# EAGLE board video_test (EAGLE 6.6.0), part 1 of 2
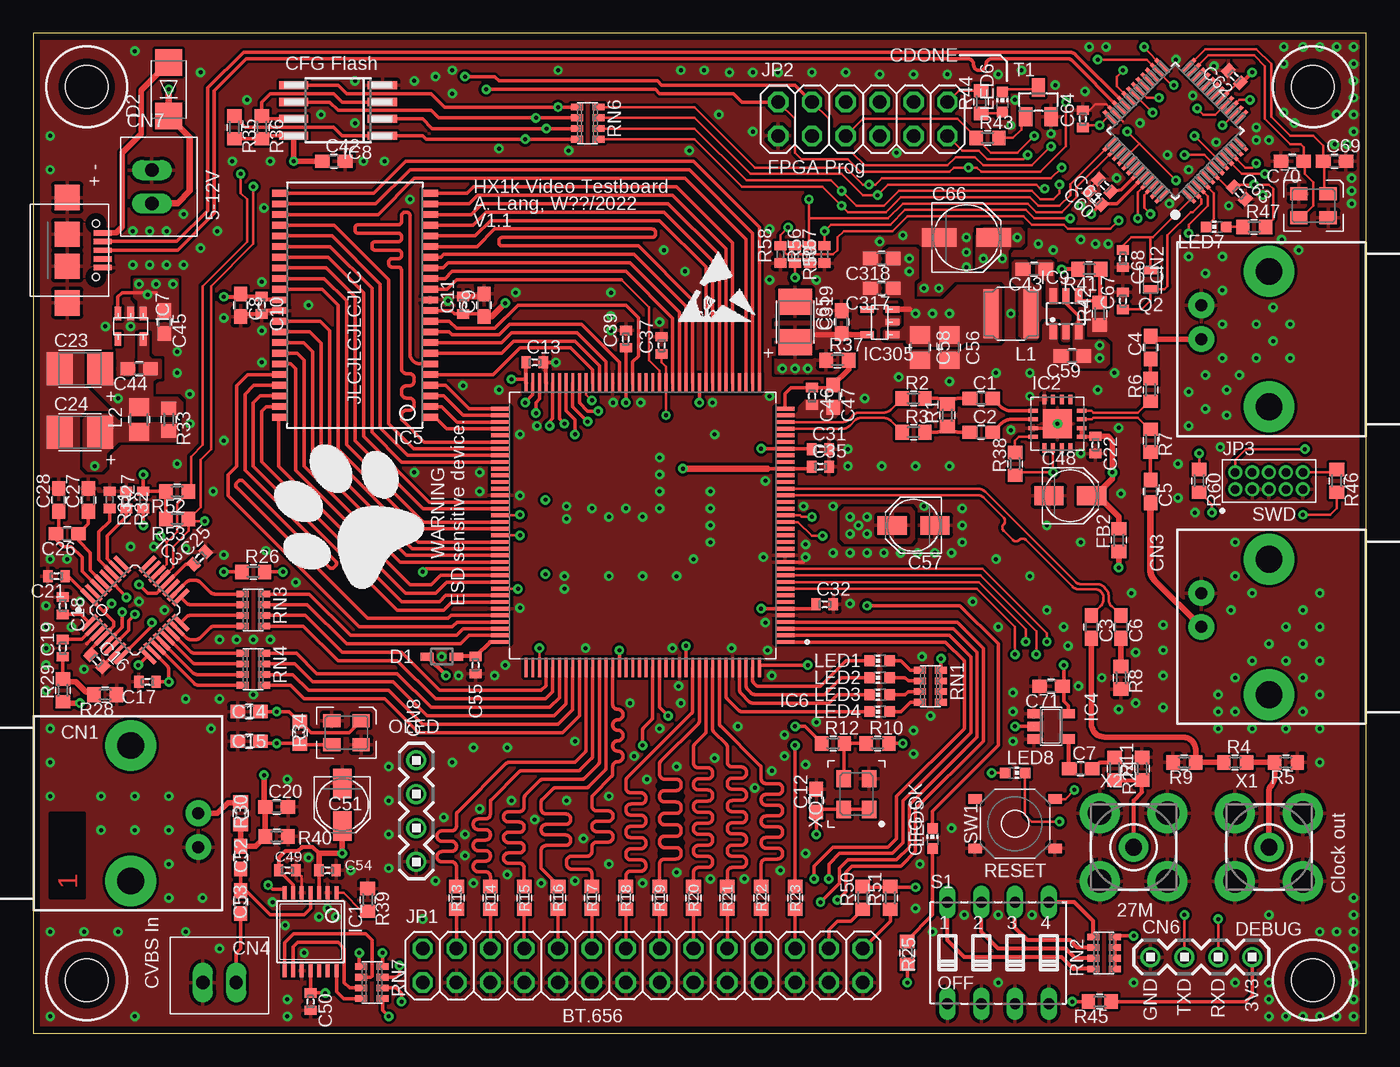
[diagram p4: board, top side]
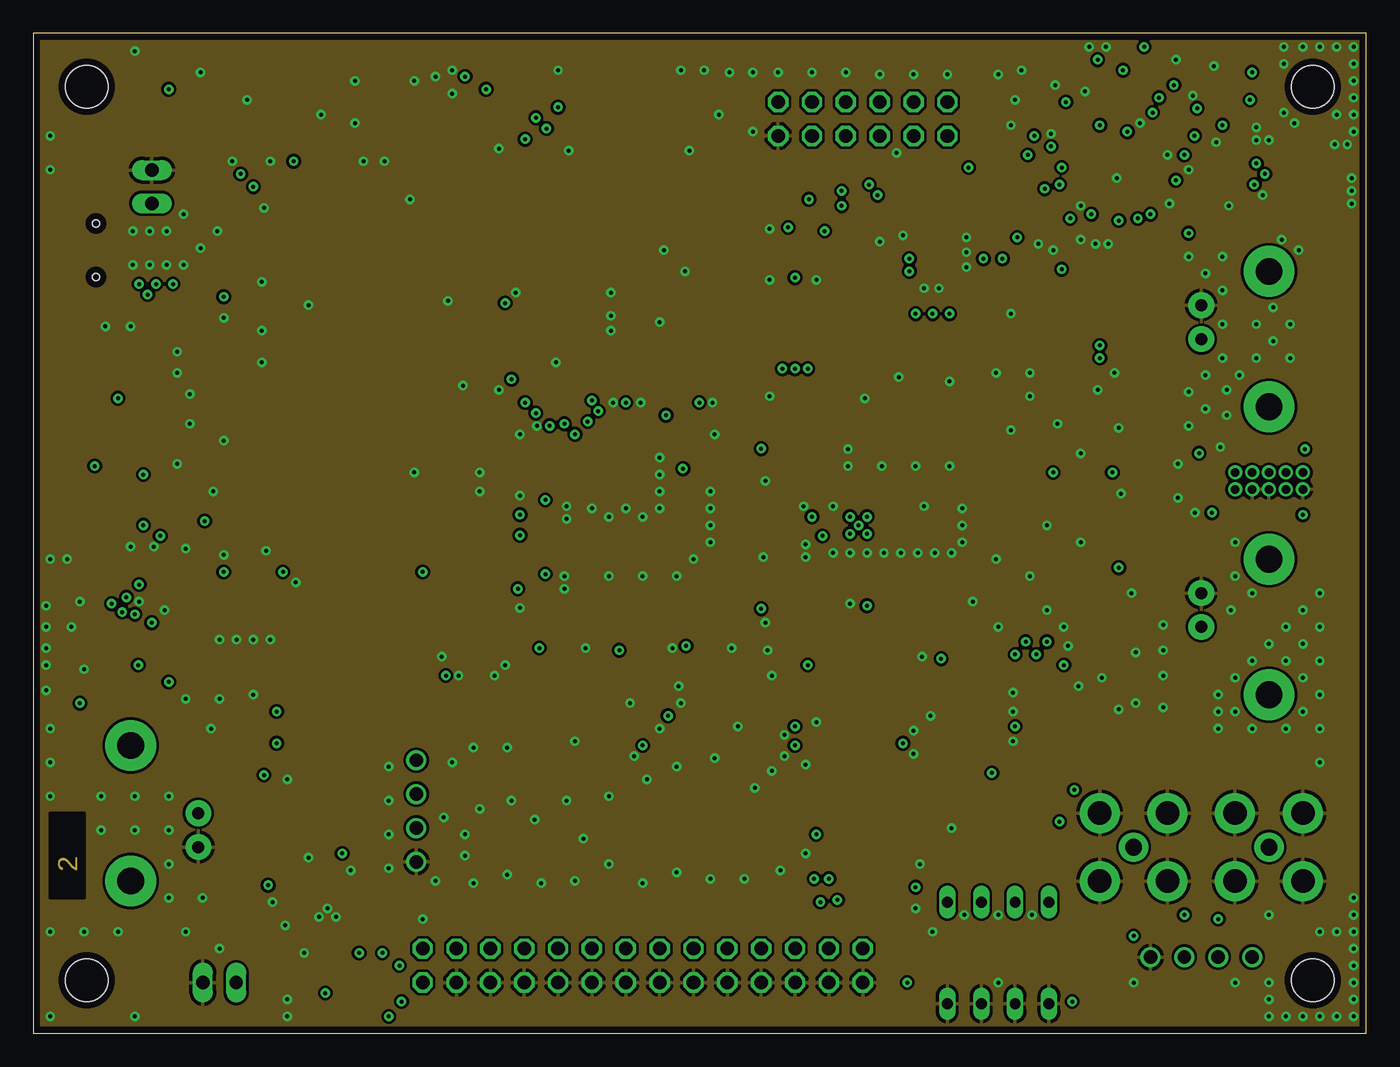
[diagram p5: board, inner layer Route2]
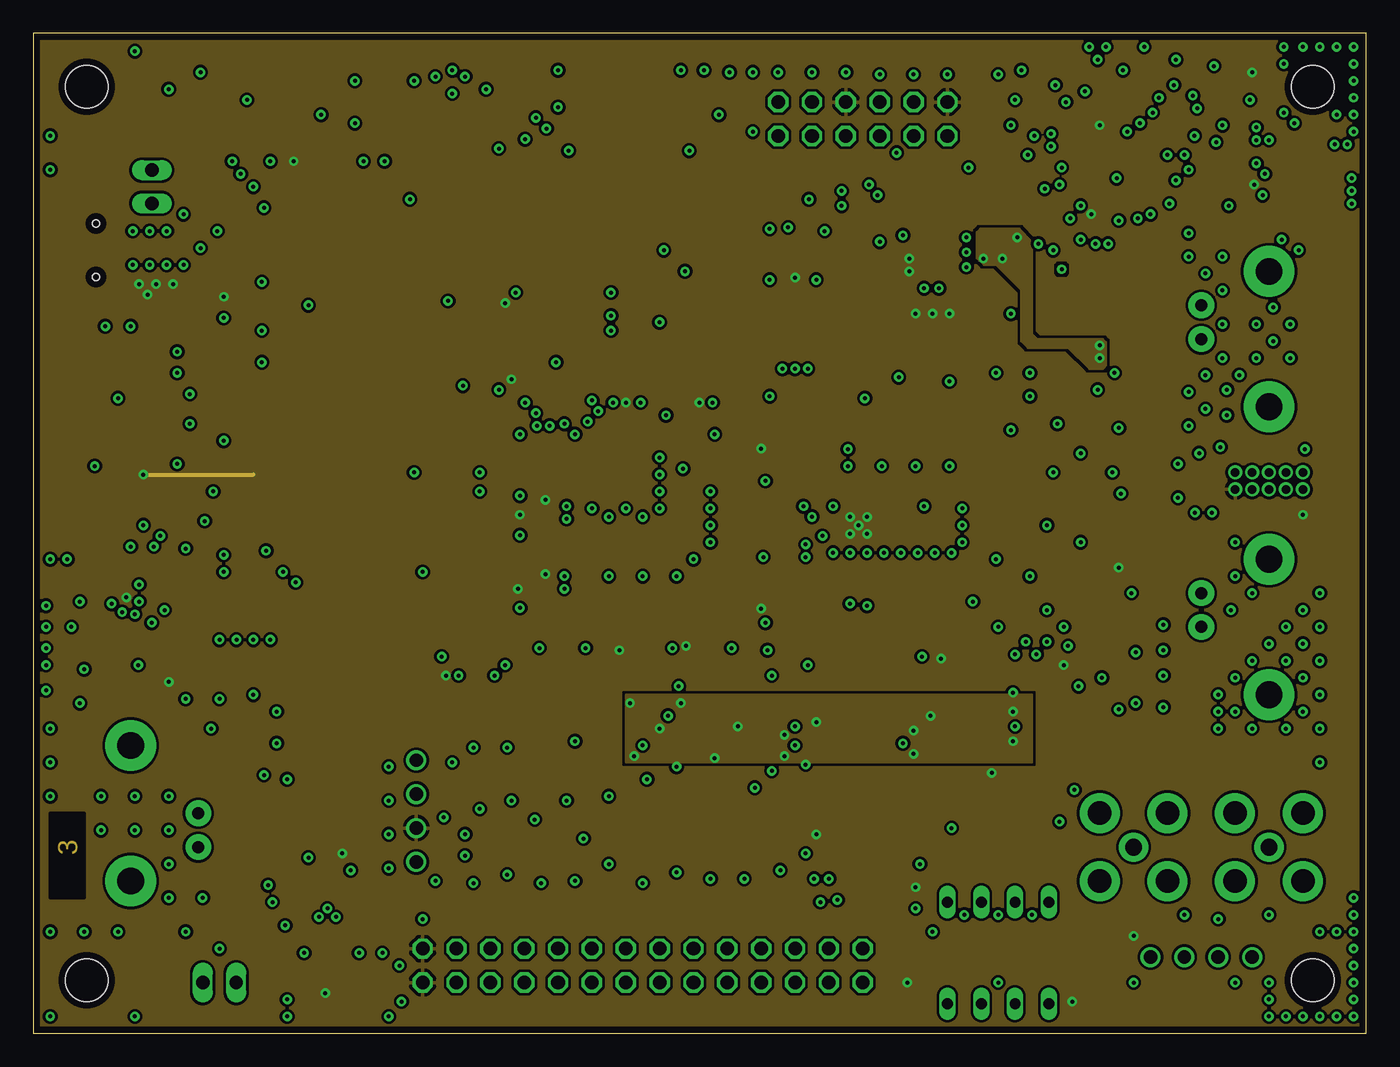
[diagram p6: board, inner layer Route15]
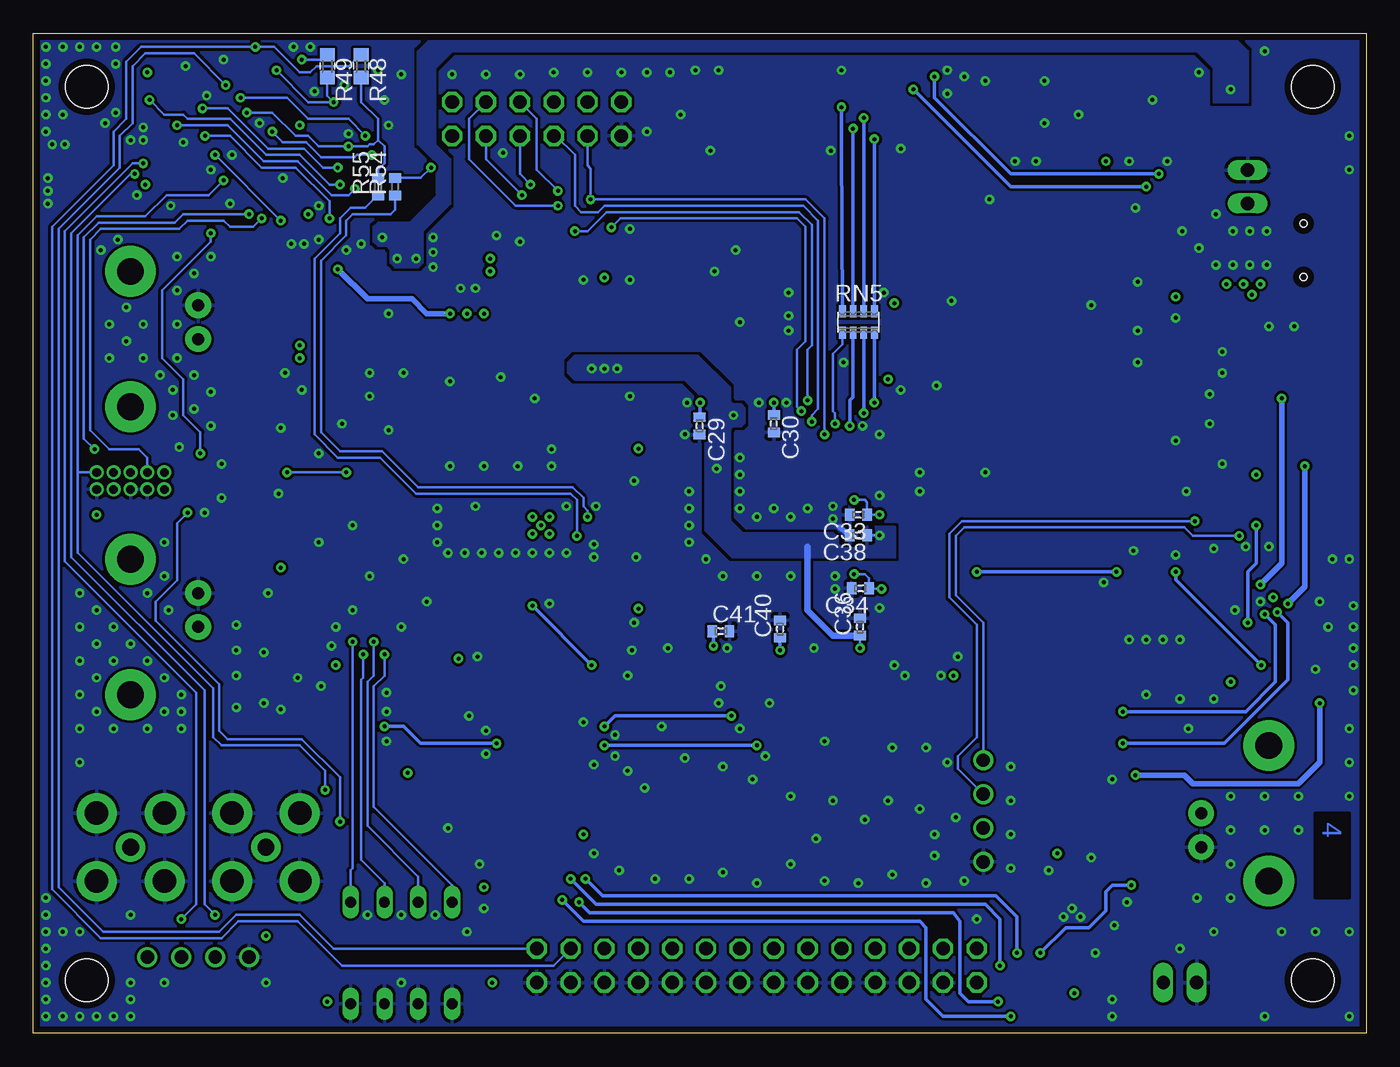
[diagram p7: board, bottom side, seen from below]

Size 100 x 75 mm. Coordinates in mm from the lower left corner, seen from the top.
Outline: 0,0 100,0 100,75 0,75 0,0
Copper layers (1*2+15*16): Top 0.035mm / dielectric 0.22mm / Route2 0.035mm / dielectric 1mm / Route15 0.035mm / dielectric 0.22mm / Bottom 0.035mm
Design rules "default *": minimum track width 0.2mm, minimum drill 0.3mm, track to track 0.2mm, track to pad 0.2mm, pad to pad 0.2mm, via to via 0.2mm, smd to smd 0.2mm, copper to edge 0.5mm, drill to drill 8mil, minimum pad ring 0.2mm, minimum via ring 8mil, stop-mask expansion 4mil, vias tented up to drill 0mil, thermal gap 10mil
Net classes: 1 100r: width 0.25 mm, clearance 0.3 mm to class 0, clearance 0.25 mm
Holes 3.2 mm at 4,71 4,4 96,4 96,71
tRestrict: 7 lines

## Footprints (pad centres in the part's own frame; a part is rotated, then mirrored left to right if it is on the bottom)
C0603 = smd 1.1 x 1: 1 -0.85,0; 2 0.85,0
C0402 = smd 0.7 x 0.9: 1 -0.65,0; 2 0.65,0
B/3528-21R = smd 1.95 x 2.5: + 1.525,0; - -1.525,0
PANASONIC_B = smd 2.2 x 1.4: + 1.6,0; - -1.6,0
C0805 = smd 1.3 x 1.5: 1 -0.95,0; 2 0.95,0
PANASONIC_C = smd 2.6 x 1.4: + 2.05,0; - -2.05,0
AMP_227161 = drill 0.9 pad 1.93: 1 0,-5.08; 2 -2.54,-5.08 | drill 2 pad 3.81: P$1 -5.08,0; P$2 5.08,0
B2B-XH = drill 1 long: 1 0,-1.25; 2 0,1.25
UJ2-MIBH-G-SMT = smd 0.4 x 1.35: 1 -1.3,2.675; 2 -0.65,2.675; 3 0,2.675; 4 0.65,2.675; 5 1.3,2.675 | smd 1.9 x 1.9: GND1 -3.95,0; GND2 -1.2,0; GND3 1.2,0; GND4 3.95,0 | hole 0.55: -2,2.15; 2,2.15
SL-254-RH-4 = drill 1: 1 -3.81,0; 2 -1.27,0; 3 1.27,0; 4 3.81,0
SOD323 = smd 1 x 0.6: A 1.1,0; K -1.1,0
SMA = smd 2 x 2: A 2,0; C -2,0
R0603 = smd 1 x 1.1: 1 -0.85,0; 2 0.85,0
TSSOP14 = smd 0.305 x 0.991: 1 -1.95,-2.918; 2 -1.3,-2.918; 3 -0.65,-2.918; 4 0,-2.918; 5 0.65,-2.918; 6 1.3,-2.918; 7 1.95,-2.918; 8 1.95,2.918; 9 1.3,2.918; 10 0.65,2.918; 11 0,2.918; 12 -0.65,2.918; 13 -1.3,2.918; 14 -1.95,2.918
QFN16_065 = smd 0.725 x 0.3: 1 -1.812,0.975; 2 -1.812,0.325; 3 -1.812,-0.325; 4 -1.812,-0.975; 9 1.812,-0.975; 10 1.812,-0.325; 11 1.812,0.325; 12 1.812,0.975 | smd 0.3 x 0.725: 5 -0.975,-1.812; 6 -0.325,-1.812; 7 0.325,-1.812; 8 0.975,-1.812; 13 0.975,1.812; 14 0.325,1.812; 15 -0.325,1.812; 16 -0.975,1.812 | smd 2.2 x 2.2: TP 0,0
SPQFP32 = smd 0.3 x 1.6: 1 -1.75,-3.1; 2 -1.25,-3.1; 3 -0.75,-3.1; 4 -0.25,-3.1; 5 0.25,-3.1; 6 0.75,-3.1; 7 1.25,-3.1; 8 1.75,-3.1; 17 1.75,3.1; 18 1.25,3.1; 19 0.75,3.1; 20 0.25,3.1; 21 -0.25,3.1; 22 -0.75,3.1; 23 -1.25,3.1; 24 -1.75,3.1 | smd 1.6 x 0.3: 9 3.1,-1.75; 10 3.1,-1.25; 11 3.1,-0.75; 12 3.1,-0.25; 13 3.1,0.25; 14 3.1,0.75; 15 3.1,1.25; 16 3.1,1.75; 25 -3.1,1.75; 26 -3.1,1.25; 27 -3.1,0.75; 28 -3.1,0.25; 29 -3.1,-0.25; 30 -3.1,-0.75; 31 -3.1,-1.25; 32 -3.1,-1.75
SOT23-5 = smd 0.69 x 0.99: 1 -0.95,-1.29; 2 0,-1.29; 3 0.95,-1.29; 4 0.95,1.3; 5 -0.95,1.3
TSOPII-Z44 = smd 0.5 x 1.2: 1 -8.4,-5.627; 2 -7.6,-5.627; 3 -6.8,-5.627; 4 -6,-5.627; 5 -5.2,-5.627; 6 -4.4,-5.627; 7 -3.6,-5.627; 8 -2.8,-5.627; 9 -2,-5.627; 10 -1.2,-5.627; 11 -0.4,-5.627; 12 0.4,-5.627; 13 1.2,-5.627; 14 2,-5.627; 15 2.8,-5.627; 16 3.6,-5.627; 17 4.4,-5.627; 18 5.2,-5.627; 19 6,-5.627; 20 6.8,-5.627; 21 7.6,-5.627; 22 8.4,-5.627; 23 8.4,5.627; 24 7.6,5.627; 25 6.8,5.627; 26 6,5.627; 27 5.2,5.627; 28 4.4,5.627; 29 3.6,5.627; 30 2.8,5.627; 31 2,5.627; 32 1.2,5.627; 33 0.4,5.627; 34 -0.4,5.627; 35 -1.2,5.627; 36 -2,5.627; 37 -2.8,5.627; 38 -3.6,5.627; 39 -4.4,5.627; 40 -5.2,5.627; 41 -6,5.627; 42 -6.8,5.627; 43 -7.6,5.627; 44 -8.4,5.627
QFP50P2200X2200X160-144N = smd 1.47 x 0.28: 1 -10.67,8.75; 2 -10.67,8.25; 3 -10.67,7.75; 4 -10.67,7.25; 5 -10.67,6.75; 6 -10.67,6.25; 7 -10.67,5.75; 8 -10.67,5.25; 9 -10.67,4.75; 10 -10.67,4.25; 11 -10.67,3.75; 12 -10.67,3.25; 13 -10.67,2.75; 14 -10.67,2.25; 15 -10.67,1.75; 16 -10.67,1.25; 17 -10.67,0.75; 18 -10.67,0.25; 19 -10.67,-0.25; 20 -10.67,-0.75; 21 -10.67,-1.25; 22 -10.67,-1.75; 23 -10.67,-2.25; 24 -10.67,-2.75; 25 -10.67,-3.25; 26 -10.67,-3.75; 27 -10.67,-4.25; 28 -10.67,-4.75; 29 -10.67,-5.25; 30 -10.67,-5.75; 31 -10.67,-6.25; 32 -10.67,-6.75; 33 -10.67,-7.25; 34 -10.67,-7.75; 35 -10.67,-8.25; 36 -10.67,-8.75; 73 10.67,-8.75; 74 10.67,-8.25; 75 10.67,-7.75; 76 10.67,-7.25; 77 10.67,-6.75; 78 10.67,-6.25; 79 10.67,-5.75; 80 10.67,-5.25; 81 10.67,-4.75; 82 10.67,-4.25; 83 10.67,-3.75; 84 10.67,-3.25; 85 10.67,-2.75; 86 10.67,-2.25; 87 10.67,-1.75; 88 10.67,-1.25; 89 10.67,-0.75; 90 10.67,-0.25; 91 10.67,0.25; 92 10.67,0.75; 93 10.67,1.25; 94 10.67,1.75; 95 10.67,2.25; 96 10.67,2.75; 97 10.67,3.25; 98 10.67,3.75; 99 10.67,4.25; 100 10.67,4.75; 101 10.67,5.25; 102 10.67,5.75; 103 10.67,6.25; 104 10.67,6.75; 105 10.67,7.25; 106 10.67,7.75; 107 10.67,8.25; 108 10.67,8.75 | smd 0.28 x 1.47: 37 -8.75,-10.67; 38 -8.25,-10.67; 39 -7.75,-10.67; 40 -7.25,-10.67; 41 -6.75,-10.67; 42 -6.25,-10.67; 43 -5.75,-10.67; 44 -5.25,-10.67; 45 -4.75,-10.67; 46 -4.25,-10.67; 47 -3.75,-10.67; 48 -3.25,-10.67; 49 -2.75,-10.67; 50 -2.25,-10.67; 51 -1.75,-10.67; 52 -1.25,-10.67; 53 -0.75,-10.67; 54 -0.25,-10.67; 55 0.25,-10.67; 56 0.75,-10.67; 57 1.25,-10.67; 58 1.75,-10.67; 59 2.25,-10.67; 60 2.75,-10.67; 61 3.25,-10.67; 62 3.75,-10.67; 63 4.25,-10.67; 64 4.75,-10.67; 65 5.25,-10.67; 66 5.75,-10.67; 67 6.25,-10.67; 68 6.75,-10.67; 69 7.25,-10.67; 70 7.75,-10.67; 71 8.25,-10.67; 72 8.75,-10.67; 109 8.75,10.67; 110 8.25,10.67; 111 7.75,10.67; 112 7.25,10.67; 113 6.75,10.67; 114 6.25,10.67; 115 5.75,10.67; 116 5.25,10.67; 117 4.75,10.67; 118 4.25,10.67; 119 3.75,10.67; 120 3.25,10.67; 121 2.75,10.67; 122 2.25,10.67; 123 1.75,10.67; 124 1.25,10.67; 125 0.75,10.67; 126 0.25,10.67; 127 -0.25,10.67; 128 -0.75,10.67; 129 -1.25,10.67; 130 -1.75,10.67; 131 -2.25,10.67; 132 -2.75,10.67; 133 -3.25,10.67; 134 -3.75,10.67; 135 -4.25,10.67; 136 -4.75,10.67; 137 -5.25,10.67; 138 -5.75,10.67; 139 -6.25,10.67; 140 -6.75,10.67; 141 -7.25,10.67; 142 -7.75,10.67; 143 -8.25,10.67; 144 -8.75,10.67
SOT23-5' = smd 0.508 x 1.016: 1 -0.945,-0.955; 2 0.005,-0.955; 3 0.955,-0.955; 4 0.955,0.945; 5 -0.945,0.945
SO-08M = smd 0.6 x 2.2: 1 -1.905,-3.33; 2 -0.635,-3.33; 3 0.635,-3.33; 4 1.905,-3.33; 5 1.905,3.33; 6 0.635,3.33; 7 -0.635,3.33; 8 -1.905,3.33
SOT23-6L = smd 0.55 x 1.2: 1 -0.95,-1.3; 2 0,-1.3; 3 0.95,-1.3; 4 0.95,1.3; 5 0,1.3; 6 -0.95,1.3
TQFP48_7X7MC_MCH = smd 1.341 x 0.279: 1 -4.176,2.75; 2 -4.176,2.25; 3 -4.176,1.75; 4 -4.176,1.25; 5 -4.176,0.75; 6 -4.176,0.25; 7 -4.176,-0.25; 8 -4.176,-0.75; 9 -4.176,-1.25; 10 -4.176,-1.75; 11 -4.176,-2.25; 12 -4.176,-2.75; 25 4.176,-2.75; 26 4.176,-2.25; 27 4.176,-1.75; 28 4.176,-1.25; 29 4.176,-0.75; 30 4.176,-0.25; 31 4.176,0.25; 32 4.176,0.75; 33 4.176,1.25; 34 4.176,1.75; 35 4.176,2.25; 36 4.176,2.75 | smd 0.279 x 1.341: 13 -2.75,-4.176; 14 -2.25,-4.176; 15 -1.75,-4.176; 16 -1.25,-4.176; 17 -0.75,-4.176; 18 -0.25,-4.176; 19 0.25,-4.176; 20 0.75,-4.176; 21 1.25,-4.176; 22 1.75,-4.176; 23 2.25,-4.176; 24 2.75,-4.176; 37 2.75,4.176; 38 2.25,4.176; 39 1.75,4.176; 40 1.25,4.176; 41 0.75,4.176; 42 0.25,4.176; 43 -0.25,4.176; 44 -0.75,4.176; 45 -1.25,4.176; 46 -1.75,4.176; 47 -2.25,4.176; 48 -2.75,4.176
2X14 = drill 1.016 octagon: 1 -16.51,-1.27; 2 -16.51,1.27; 3 -13.97,-1.27; 4 -13.97,1.27; 5 -11.43,-1.27; 6 -11.43,1.27; 7 -8.89,-1.27; 8 -8.89,1.27; 9 -6.35,-1.27; 10 -6.35,1.27; 11 -3.81,-1.27; 12 -3.81,1.27; 13 -1.27,-1.27; 14 -1.27,1.27; 15 1.27,-1.27; 16 1.27,1.27; 17 3.81,-1.27; 18 3.81,1.27; 19 6.35,-1.27; 20 6.35,1.27; 21 8.89,-1.27; 22 8.89,1.27; 23 11.43,-1.27; 24 11.43,1.27; 25 13.97,-1.27; 26 13.97,1.27; 27 16.51,-1.27; 28 16.51,1.27
2X06 = drill 1.016 octagon: 1 -6.35,-1.27; 2 -6.35,1.27; 3 -3.81,-1.27; 4 -3.81,1.27; 5 -1.27,-1.27; 6 -1.27,1.27; 7 1.27,-1.27; 8 1.27,1.27; 9 3.81,-1.27; 10 3.81,1.27; 11 6.35,-1.27; 12 6.35,1.27
SL127-2X5 = drill 0.65 pad 1.05: 1 -2.54,-0.635; 2 -2.54,0.635; 3 -1.27,-0.635; 4 -1.27,0.635; 5 0,-0.635; 6 0,0.635; 7 1.27,-0.635; 8 1.27,0.635; 9 2.54,-0.635; 10 2.54,0.635
TYA4020 = smd 1.1 x 3.7: 1 -1.5,0; 2 1.5,0
R0805 = smd 1.3 x 1.5: 1 -0.95,0; 2 0.95,0
CHIP-LED0603 = smd 0.8 x 0.8: A 0,-0.75; C 0,0.75
MT = smd 1.3 x 1: 1 -1.1,-0.9; 2 1.1,-0.9; 3 1.1,0.9; 4 -1.1,0.9
IQXC-25 = smd 0.6 x 1.1: 1 -0.7,0; 2 0.7,0
R0402 = smd 0.7 x 0.9: 1 -0.65,0; 2 0.65,0
CTS742C083 = smd 0.5 x 0.9: 1 -1.2,-0.8; 2 -0.4,-0.8; 3 0.4,-0.8; 4 1.2,-0.8; 5 1.2,0.8; 6 0.4,0.8; 7 -0.4,0.8; 8 -1.2,0.8
DIP04S = drill 0.813 long: 1 -3.81,-3.81; 2 -1.27,-3.81; 3 1.27,-3.81; 4 3.81,-3.81; 5 3.81,3.81; 6 1.27,3.81; 7 -1.27,3.81; 8 -3.81,3.81
PTS526 = smd 1 x 0.7: 1 -3,1.85; 2 3,1.85; 3 -3,-1.85; 4 3,-1.85
SOT23 = smd 1 x 1.4: 1 -0.95,-1.1; 2 0.95,-1.1; 3 0,1.1
BU-SMA-V = drill 1.27 pad 2.184: 1 0,0 | drill 1.778 pad 3: 2 -2.55,2.55; 3 2.55,2.55; 4 2.55,-2.55; 5 -2.55,-2.55
ECS-2333 = smd 1.3 x 1.1: 1 -1.15,-0.95; 2 1.15,-0.95; 3 1.15,0.95; 4 -1.15,0.95

## Placement (x,y rotation side)
C1  4u7  [C0603]  71.12,47.62 0 top
C2  4u7  [C0603]  71.12,45.09 0 top
C3  100n  [C0603]  79.38,30.48 270 top
C4  4u7  [C0603]  83.82,51.44 90 top
C5  4u7  [C0603]  83.82,40.64 270 top
C6  100n  [C0603]  81.6,30.48 270 top
C7  100n  [C0603]  78.58,19.84 0 top
C8  100n  [C0603]  15.56,54.61 270 top
C9  100n  [C0603]  33.81,54.61 90 top
C10  100n  [C0402]  17.14,54.61 270 top
C11  100n  [C0402]  32.23,54.61 90 top
C12  100n  [C0603]  58.74,17.46 90 top
C13  100n  [C0402]  37.62,50.32 0 top
C14  22p  [C0603]  16.19,24.13 180 top
C15  22p  [C0603]  16.19,21.91 180 top
C16  100n  [C0402]  4.76,27.94 315 top
C17  100n  [C0402]  8.57,26.35 180 top
C18  100n  [C0402]  2.22,32.07 270 top
C19  100n  [C0402]  2.22,28.89 90 top
C20  [C0603]  18.26,16.99 0 top
C21  100n  [C0402]  1.75,34.29 180 top
C22  100n  [C0402]  79.69,44.13 270 top
C23  22µ  [B/3528-21R]  3.49,49.85 0 top
C24  22µ  [B/3528-21R]  3.49,45.09 0 top
C25  100n  [C0402]  12.48,35.65 45 top
C26  1u  [C0603]  2.54,37.47 180 top
C27  1u  [C0603]  4.13,40.01 90 top
C28  1u  [C0603]  1.91,40.01 90 top
C29  100n  [C0402]  50.01,45.56 270 bottom
C30  100n  [C0402]  44.45,45.72 270 bottom
C31  100n  [C0402]  59.05,43.81 0 top
C32  100n  [C0402]  59.37,32.17 0 top
C33  100n  [C0402]  38.1,38.89 180 bottom
C34  100n  [C0402]  37.94,33.37 180 bottom
C35  100n  [C0402]  59.05,42.51 0 top
C36  100n  [C0402]  37.97,30.48 90 bottom
C37  100n  [C0402]  47.15,51.59 90 top
C38  100n  [C0402]  38.1,37.35 180 bottom
C39  100n  [C0402]  44.45,52.07 90 top
C40  100n  [C0402]  43.97,30.32 90 bottom
C41  100n  [C0402]  48.42,30.16 0 bottom
C42  100n  [C0603]  22.54,65.41 0 top
C43  100n  [C0603]  75.09,57.31 180 top
C44  100n  [C0603]  7.94,49.85 180 top
C45  100n  [C0603]  9.84,53.34 270 top
C46  100n  [C0402]  58.42,47.78 270 top
C47  100n  [C0603]  60.01,47.78 270 top
C48  22µ  [PANASONIC_B]  77.79,40.32 0 top
C49  NP  [C0402]  19.05,12.22 0 top
C50  NP  [C0402]  20.8,2.38 270 top
C51  22µ  [PANASONIC_B]  23.18,17.14 270 top
C52  NP  [C0603]  15.56,13.18 270 top
C53  NP  [C0603]  15.56,9.84 90 top
C54  NP  [C0402]  22.07,12.22 0 top
C55  100n  [C0402]  33.18,27.62 270 top
C56  22µ  [C0805]  68.74,51.44 270 top
C57  22µ  [PANASONIC_B]  66.04,38.1 180 top
C58  22µ  [C0805]  66.52,51.44 270 top
C59  100n  [C0603]  77.95,50.8 180 top
C60  100n  [C0402]  79.69,62.61 135 top
C61  100n  [C0402]  80.37,63.59 135 top
C62  100n  [C0402]  90.1,71.75 135 top
C63  100n  [C0402]  90.49,63.02 315 top
C64  100n  [C0402]  78.74,68.58 90 top
C65  [B/3528-21R]  57.15,53.34 270 top
C66  22µ  [PANASONIC_C]  70.01,59.69 0 top
C67  [C0402]  81.76,54.93 90 top
C68  [C0402]  81.76,58.1 270 top
C69  NP  [C0603]  97.63,65.41 0 top
C70  NP  [C0603]  94.46,65.41 180 top
C71  100n  [C0603]  76.36,26.04 180 top
C317  100n  [C0603]  63.66,55.88 180 top
C318  1u  [C0603]  63.66,58.1 180 top
C319  1u  [C0603]  60.64,53.34 90 top
CN1  [AMP_227161]  7.3,16.51 90 top
CN2  [AMP_227161]  92.71,52.07 270 top
CN3  [AMP_227161]  92.71,30.48 270 top
CN4  [B2B-XH]  13.97,3.81 90 top
CN5  [UJ2-MIBH-G-SMT]  2.54,58.74 270 top
CN6  DEBUG  [SL-254-RH-4]  87.63,5.71 0 top
CN7  [B2B-XH]  8.89,63.5 0 top
CN8  OLED  [SL-254-RH-4]  28.73,16.67 90 top
D1  1N4148-WS  [SOD323]  30.64,28.26 180 top
D2  MBRA120  [SMA]  10.16,70.8 90 top
FB2  [R0603]  81.44,36.99 90 top
IC1  LMH1981PW  [TSSOP14]  20.8,7.62 180 top
IC2  EQCO30T5.2  [QFN16_065]  76.83,45.72 0 top
IC3  TVP5151  [SPQFP32]  7.62,31.75 315 top
IC4  74LVC1G125DBV  [SOT23-5]  76.36,23.02 270 top
IC5  AS7C38098T  [TSOPII-Z44]  24.13,54.61 90 top
IC6  HX1K-TQ144  [QFP50P2200X2200X160-144N]  45.72,38.1 180 top
IC7  NCP115ASN180  [SOT23-5']  7.3,53.02 180 top
IC8  W25Q64JVSS  [SO-08M]  22.86,69.22 90 top
IC9  AP62301WU  [SOT23-6L]  77.47,53.98 0 top
IC10  ATSAMD21G18A-AU  [TQFP48_7X7MC_MCH]  85.69,67.68 135 top
IC305  AP2127K-1.2  [SOT23-5']  63.5,53.34 90 top
JP1  [2X14]  45.72,5.08 0 top
JP2  PROG  [2X06]  62.23,68.58 0 top
JP3  [SL127-2X5]  92.71,41.43 0 top
L1  [TYA4020]  73.34,53.98 180 top
L2  FB  [R0805]  7.94,46.04 90 top
LED1  [CHIP-LED0603]  63.5,27.94 90 top
LED2  [CHIP-LED0603]  63.5,26.67 90 top
LED3  [CHIP-LED0603]  63.5,25.4 90 top
LED4  [CHIP-LED0603]  63.5,24.13 90 top
LED5  [CHIP-LED0603]  67.47,14.61 0 top
LED6  [CHIP-LED0603]  72.71,69.85 0 top
LED7  [CHIP-LED0603]  88.74,60.48 90 top
LED8  [CHIP-LED0603]  73.66,19.53 270 top
Q1  27M  [MT]  23.5,22.54 180 top
Q2  32kHz  [IQXC-25]  83.82,56.52 270 top
Q3  NP  [MT]  96.04,62.07 180 top
R1  100  [R0603]  68.58,46.35 90 top
R2  100  [R0603]  66.04,47.62 0 top
R3  100  [R0603]  66.04,45.09 0 top
R4  100  [R0603]  90.17,20.32 0 top
R5  100  [R0603]  93.98,20.32 180 top
R6  25  [R0603]  83.82,48.26 90 top
R7  25  [R0603]  83.82,44.45 270 top
R8  49.9  [R0603]  81.6,26.67 270 top
R9  82  [R0603]  86.36,20.32 180 top
R10  22  [R0603]  63.34,21.75 0 top
R11  100  [R0603]  83.19,19.84 90 top
R12  22  [R0603]  60.01,21.75 0 top
R13  33  [R0603]  31.75,10.16 90 top
R14  33  [R0603]  34.29,10.16 90 top
R15  33  [R0603]  36.83,10.16 90 top
R16  33  [R0603]  39.37,10.16 90 top
R17  33  [R0603]  41.91,10.16 90 top
R18  33  [R0603]  44.45,10.16 90 top
R19  33  [R0603]  46.99,10.16 90 top
R20  33  [R0603]  49.53,10.16 90 top
R21  33  [R0603]  52.07,10.16 90 top
R22  33  [R0603]  54.61,10.16 90 top
R23  33  [R0603]  57.15,10.16 90 top
R24  100  [R0603]  81.12,19.84 270 top
R25  330  [R0603]  65.56,6.03 270 top
R26  33  [R0603]  16.51,34.61 0 top
R27  10k  [R0402]  8.26,40.01 90 top
R28  37.4  [R0603]  5.4,25.4 180 top
R29  37.4  [R0603]  2.22,25.72 90 top
R30  0  [R0603]  15.56,16.51 270 top
R31  10k  [R0402]  5.71,40.01 270 top
R32  10k  [R0402]  6.99,40.01 270 top
R33  NP  [R0603]  10.16,46.04 270 top
R34  1M  [R0603]  20,22.54 90 top
R35  10k  [R0603]  15.08,67.94 270 top
R36  10k  [R0603]  17.14,67.94 270 top
R37  [R0603]  60.33,50.48 0 top
R38  750  [R0603]  73.66,42.7 90 top
R39  NP  [R0603]  25.08,10 270 top
R40  NP  [R0603]  18.26,14.76 180 top
R41  31k6  [R0603]  79.22,57.31 180 top
R42  10k  [R0603]  80.01,53.98 90 top
R43  330  [R0603]  71.6,67.15 0 top
R44  330  [R0603]  71.12,69.85 90 top
R45  0  [R0603]  80.01,2.38 180 top
R46  10k  [R0603]  97.79,41.43 270 top
R47  330  [R0603]  91.6,60.48 0 top
R48  NP  [R0603]  75.41,72.55 270 bottom
R49  NP  [R0603]  77.95,72.55 270 bottom
R50  4k7  [R0603]  62.23,10.16 90 top
R51  4k7  [R0603]  64.29,10.16 90 top
R52  4k7  [R0603]  10.79,40.64 180 top
R53  4k7  [R0603]  10.79,38.58 180 top
R54  NP  [R0402]  72.87,63.5 90 bottom
R55  NP  [R0402]  74.14,63.5 90 bottom
R56  NP  [R0402]  58.26,58.42 90 top
R57  10k  [R0402]  59.37,58.42 90 top
R58  10k  [R0402]  56.04,58.42 90 top
R59  10k  [R0402]  57.15,58.42 270 top
R60  330  [R0603]  87.47,41.43 270 top
RN1  330  [CTS742C083]  67.31,26.04 270 top
RN2  10k  [CTS742C083]  80.33,6.03 90 top
RN3  33  [CTS742C083]  16.51,31.75 270 top
RN4  33  [CTS742C083]  16.51,27.3 270 top
RN5  33  [CTS742C083]  38.1,53.34 0 bottom
RN6  33  [CTS742C083]  41.59,68.26 270 top
RN7  NP  [CTS742C083]  25.4,3.81 270 top
S1  [DIP04S]  72.39,6.03 0 top
SW1  RESET  [PTS526]  73.66,15.72 180 top
T1  IRLML2402  [SOT23]  75.41,69.85 0 top
X1  Clock out  [BU-SMA-V]  92.71,13.97 0 top
X2  Xtal clock  [BU-SMA-V]  82.55,13.97 0 top
XO1  27MHz  [ECS-2333]  61.75,17.94 90 top